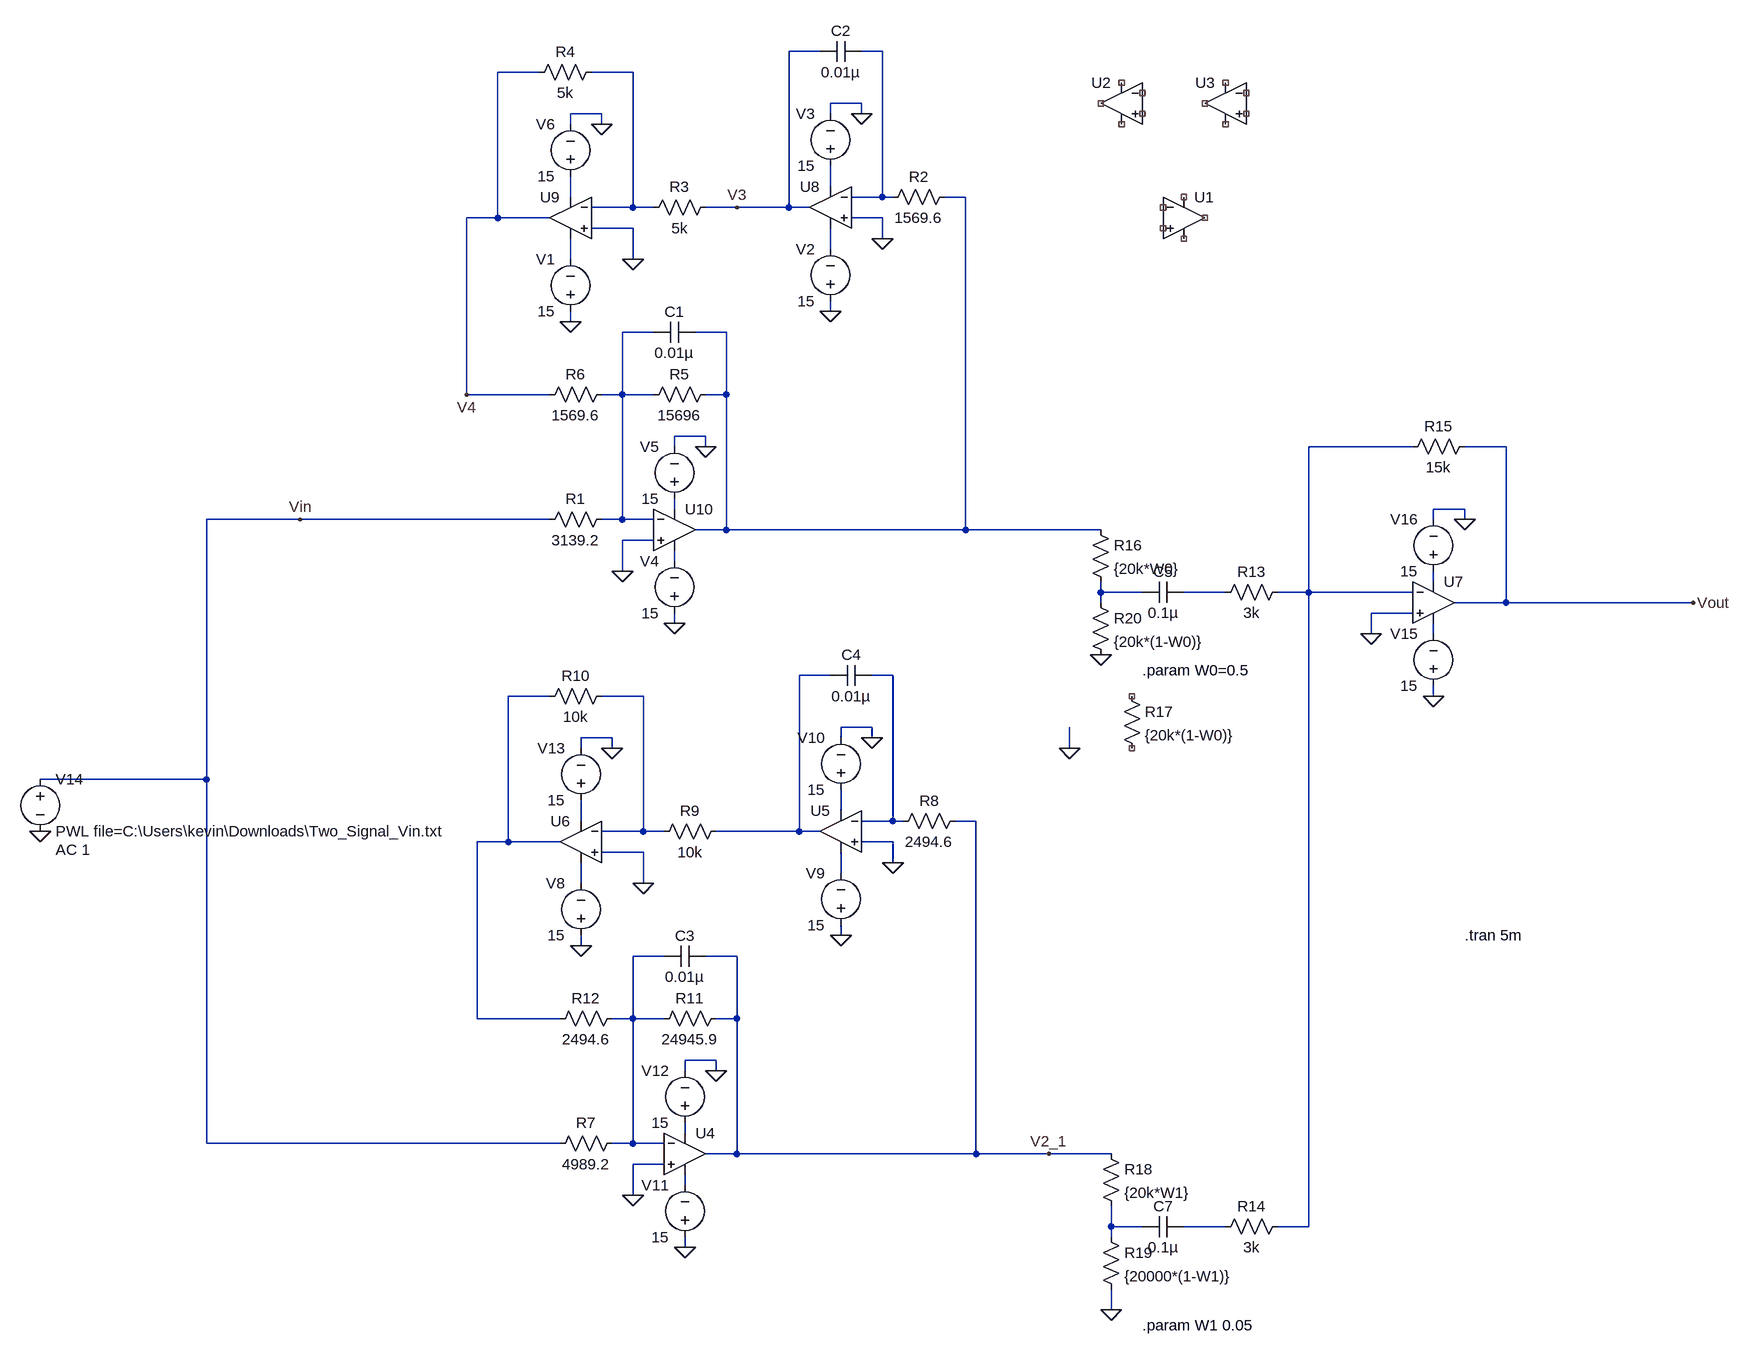
[diagram p0: schematic Full_Equalizer_Circuit_with_Noise.asc]
Full_Equalizer_Circuit_with_Noise.asc, the LTspice schematic file:
Version 4.1
SHEET 1 2996 1544
WIRE 304 -432 256 -432
WIRE 400 -432 368 -432
WIRE -128 -400 -192 -400
WIRE 16 -400 -48 -400
WIRE 368 -352 320 -352
WIRE -32 -336 -80 -336
WIRE 320 -336 320 -352
WIRE 368 -336 368 -352
WIRE -80 -320 -80 -336
WIRE -32 -320 -32 -336
WIRE 320 -224 320 -256
WIRE -80 -208 -80 -240
WIRE 400 -208 400 -432
WIRE 400 -208 352 -208
WIRE 416 -208 400 -208
WIRE 528 -208 496 -208
WIRE 16 -192 16 -400
WIRE 16 -192 -48 -192
WIRE 48 -192 16 -192
WIRE 176 -192 128 -192
WIRE 256 -192 256 -432
WIRE 256 -192 176 -192
WIRE 288 -192 256 -192
WIRE -192 -176 -192 -400
WIRE -192 -176 -240 -176
WIRE -112 -176 -192 -176
WIRE 400 -176 352 -176
WIRE 16 -160 -48 -160
WIRE 400 -144 400 -176
WIRE 320 -128 320 -160
WIRE -80 -112 -80 -144
WIRE 16 -112 16 -160
WIRE 320 -32 320 -48
WIRE -80 -16 -80 -32
WIRE 48 0 0 0
WIRE 160 0 112 0
WIRE -240 96 -240 -176
WIRE -112 96 -240 96
WIRE 0 96 0 0
WIRE 0 96 -32 96
WIRE 48 96 0 96
WIRE 160 96 160 0
WIRE 160 96 128 96
WIRE 128 160 80 160
WIRE 80 176 80 160
WIRE 128 176 128 160
WIRE 1216 176 1056 176
WIRE 1360 176 1296 176
WIRE 80 272 80 256
WIRE 1296 272 1248 272
WIRE -496 288 -640 288
WIRE -112 288 -496 288
WIRE 0 288 0 96
WIRE 0 288 -32 288
WIRE 48 288 0 288
WIRE 1248 288 1248 272
WIRE 1296 288 1296 272
WIRE 160 304 160 96
WIRE 160 304 112 304
WIRE 528 304 528 -208
WIRE 528 304 160 304
WIRE 736 304 528 304
WIRE 48 320 0 320
WIRE 80 352 80 336
WIRE 0 368 0 320
WIRE 1248 384 1248 368
WIRE 736 400 736 384
WIRE 800 400 736 400
WIRE 928 400 864 400
WIRE 1056 400 1056 176
WIRE 1056 400 1008 400
WIRE 1216 400 1056 400
WIRE 736 416 736 400
WIRE 1360 416 1360 176
WIRE 1360 416 1280 416
WIRE 1648 416 1360 416
WIRE 1216 432 1152 432
WIRE 80 448 80 432
WIRE 1152 464 1152 432
WIRE 1248 464 1248 448
WIRE 320 528 272 528
WIRE 416 528 384 528
WIRE -112 560 -176 560
WIRE 32 560 -32 560
WIRE 1248 560 1248 544
WIRE 384 608 336 608
WIRE -16 624 -64 624
WIRE 336 624 336 608
WIRE 384 624 384 608
WIRE -64 640 -64 624
WIRE -16 640 -16 624
WIRE 688 640 688 608
WIRE -640 688 -640 288
WIRE -640 688 -896 688
WIRE 336 736 336 704
WIRE -64 752 -64 720
WIRE 416 752 416 528
WIRE 416 752 368 752
WIRE 432 752 416 752
WIRE 544 752 512 752
WIRE 32 768 32 560
WIRE 32 768 -32 768
WIRE 64 768 32 768
WIRE 272 768 272 528
WIRE 272 768 144 768
WIRE 304 768 272 768
WIRE -176 784 -176 560
WIRE -176 784 -224 784
WIRE -96 784 -176 784
WIRE 416 784 368 784
WIRE 32 800 -32 800
WIRE 416 816 416 784
WIRE 336 832 336 800
WIRE -64 848 -64 816
WIRE 32 848 32 800
WIRE 336 928 336 912
WIRE -64 944 -64 928
WIRE 64 960 16 960
WIRE 176 960 128 960
WIRE -224 1056 -224 784
WIRE -96 1056 -224 1056
WIRE 16 1056 16 960
WIRE 16 1056 -16 1056
WIRE 64 1056 16 1056
WIRE 176 1056 176 960
WIRE 176 1056 144 1056
WIRE 144 1120 96 1120
WIRE 96 1136 96 1120
WIRE 144 1136 144 1120
WIRE 96 1232 96 1216
WIRE -640 1248 -640 688
WIRE -96 1248 -640 1248
WIRE 16 1248 16 1056
WIRE 16 1248 -16 1248
WIRE 64 1248 16 1248
WIRE 176 1264 176 1056
WIRE 176 1264 128 1264
WIRE 544 1264 544 752
WIRE 544 1264 176 1264
WIRE 656 1264 544 1264
WIRE 752 1264 656 1264
WIRE 64 1280 16 1280
WIRE 96 1312 96 1296
WIRE 16 1328 16 1280
WIRE 752 1376 752 1344
WIRE 800 1376 752 1376
WIRE 928 1376 864 1376
WIRE 1056 1376 1056 400
WIRE 1056 1376 1008 1376
WIRE 752 1392 752 1376
WIRE 96 1408 96 1392
WIRE 752 1504 752 1472
FLAG 0 368 0
FLAG 16 -112 0
FLAG 176 -192 V3
FLAG -80 -16 0
FLAG 368 -336 0
FLAG 320 -32 0
FLAG 128 176 0
FLAG 80 448 0
FLAG -240 96 V4
FLAG 400 -144 0
FLAG -32 -320 0
FLAG 16 1328 0
FLAG 32 848 0
FLAG -64 944 0
FLAG 384 624 0
FLAG 336 928 0
FLAG 144 1136 0
FLAG 96 1408 0
FLAG 416 816 0
FLAG -16 640 0
FLAG 1296 288 0
FLAG 1248 560 0
FLAG 1152 464 0
FLAG 1648 416 Vout
FLAG 688 640 0
FLAG 752 1504 0
FLAG -896 768 0
FLAG -496 288 Vin
FLAG 656 1264 V2_1
FLAG 736 496 0
SYMBOL res -16 272 R90
WINDOW 0 0 56 VBottom 2
WINDOW 3 32 56 VTop 2
SYMATTR InstName R1
SYMATTR Value 3139.2
SYMBOL res 512 -224 R90
WINDOW 0 0 56 VBottom 2
WINDOW 3 32 56 VTop 2
SYMATTR InstName R2
SYMATTR Value 1569.6
SYMBOL res 144 -208 R90
WINDOW 0 0 56 VBottom 2
WINDOW 3 32 56 VTop 2
SYMATTR InstName R3
SYMATTR Value 5k
SYMBOL voltage -80 -16 R180
WINDOW 0 24 96 Left 2
WINDOW 3 24 16 Left 2
SYMATTR InstName V1
SYMATTR Value 15
SYMBOL res -32 -416 R90
WINDOW 0 0 56 VBottom 2
WINDOW 3 32 56 VTop 2
SYMATTR InstName R4
SYMATTR Value 5k
SYMBOL voltage 320 -32 R180
WINDOW 0 24 96 Left 2
WINDOW 3 24 16 Left 2
SYMATTR InstName V2
SYMATTR Value 15
SYMBOL voltage 320 -240 R180
WINDOW 0 24 96 Left 2
WINDOW 3 24 16 Left 2
SYMATTR InstName V3
SYMATTR Value 15
SYMBOL voltage 80 448 R180
WINDOW 0 24 96 Left 2
WINDOW 3 24 16 Left 2
SYMATTR InstName V4
SYMATTR Value 15
SYMBOL voltage 80 272 R180
WINDOW 0 24 96 Left 2
WINDOW 3 24 16 Left 2
SYMATTR InstName V5
SYMATTR Value 15
SYMBOL res 144 80 R90
WINDOW 0 0 56 VBottom 2
WINDOW 3 32 56 VTop 2
SYMATTR InstName R5
SYMATTR Value 15696
SYMBOL cap 112 -16 R90
WINDOW 0 0 32 VBottom 2
WINDOW 3 32 32 VTop 2
SYMATTR InstName C1
SYMATTR Value 0.01µ
SYMBOL cap 368 -448 R90
WINDOW 0 0 32 VBottom 2
WINDOW 3 32 32 VTop 2
SYMATTR InstName C2
SYMATTR Value 0.01µ
SYMBOL res -16 80 R90
WINDOW 0 0 56 VBottom 2
WINDOW 3 32 56 VTop 2
SYMATTR InstName R6
SYMATTR Value 1569.6
SYMBOL voltage -80 -224 R180
WINDOW 0 24 96 Left 2
WINDOW 3 24 16 Left 2
SYMATTR InstName V6
SYMATTR Value 15
SYMBOL res 0 1232 R90
WINDOW 0 0 56 VBottom 2
WINDOW 3 32 56 VTop 2
SYMATTR InstName R7
SYMATTR Value 4989.2
SYMBOL res 528 736 R90
WINDOW 0 0 56 VBottom 2
WINDOW 3 32 56 VTop 2
SYMATTR InstName R8
SYMATTR Value 2494.6
SYMBOL res 160 752 R90
WINDOW 0 0 56 VBottom 2
WINDOW 3 32 56 VTop 2
SYMATTR InstName R9
SYMATTR Value 10k
SYMBOL voltage -64 944 R180
WINDOW 0 24 96 Left 2
WINDOW 3 24 16 Left 2
SYMATTR InstName V8
SYMATTR Value 15
SYMBOL res -16 544 R90
WINDOW 0 0 56 VBottom 2
WINDOW 3 32 56 VTop 2
SYMATTR InstName R10
SYMATTR Value 10k
SYMBOL voltage 336 928 R180
WINDOW 0 24 96 Left 2
WINDOW 3 24 16 Left 2
SYMATTR InstName V9
SYMATTR Value 15
SYMBOL voltage 336 720 R180
WINDOW 0 24 96 Left 2
WINDOW 3 24 16 Left 2
SYMATTR InstName V10
SYMATTR Value 15
SYMBOL voltage 96 1408 R180
WINDOW 0 24 96 Left 2
WINDOW 3 24 16 Left 2
SYMATTR InstName V11
SYMATTR Value 15
SYMBOL voltage 96 1232 R180
WINDOW 0 24 96 Left 2
WINDOW 3 24 16 Left 2
SYMATTR InstName V12
SYMATTR Value 15
SYMBOL res 160 1040 R90
WINDOW 0 0 56 VBottom 2
WINDOW 3 32 56 VTop 2
SYMATTR InstName R11
SYMATTR Value 24945.9
SYMBOL cap 128 944 R90
WINDOW 0 0 32 VBottom 2
WINDOW 3 32 32 VTop 2
SYMATTR InstName C3
SYMATTR Value 0.01µ
SYMBOL cap 384 512 R90
WINDOW 0 0 32 VBottom 2
WINDOW 3 32 32 VTop 2
SYMATTR InstName C4
SYMATTR Value 0.01µ
SYMBOL res 0 1040 R90
WINDOW 0 0 56 VBottom 2
WINDOW 3 32 56 VTop 2
SYMATTR InstName R12
SYMATTR Value 2494.6
SYMBOL voltage -64 736 R180
WINDOW 0 24 96 Left 2
WINDOW 3 24 16 Left 2
SYMATTR InstName V13
SYMATTR Value 15
SYMBOL cap 864 384 R90
WINDOW 0 0 32 VBottom 2
WINDOW 3 32 32 VTop 2
SYMATTR InstName C5
SYMATTR Value 0.1µ
SYMBOL cap 864 1360 R90
WINDOW 0 0 32 VBottom 2
WINDOW 3 32 32 VTop 2
SYMATTR InstName C7
SYMATTR Value 0.1µ
SYMBOL res 1024 384 R90
WINDOW 0 0 56 VBottom 2
WINDOW 3 32 56 VTop 2
SYMATTR InstName R13
SYMATTR Value 3k
SYMBOL res 1024 1360 R90
WINDOW 0 0 56 VBottom 2
WINDOW 3 32 56 VTop 2
SYMATTR InstName R14
SYMATTR Value 3k
SYMBOL voltage 1248 560 R180
WINDOW 0 24 96 Left 2
WINDOW 3 24 16 Left 2
SYMATTR InstName V15
SYMATTR Value 15
SYMBOL voltage 1248 384 R180
WINDOW 0 24 96 Left 2
WINDOW 3 24 16 Left 2
SYMATTR InstName V16
SYMATTR Value 15
SYMBOL res 1312 160 R90
WINDOW 0 0 56 VBottom 2
WINDOW 3 32 56 VTop 2
SYMATTR InstName R15
SYMATTR Value 15k
SYMBOL res 720 288 R0
SYMATTR InstName R16
SYMATTR Value {20k*W0}
SYMBOL res 768 544 R0
SYMATTR InstName R17
SYMATTR Value {20k*(1-W0)}
SYMBOL res 736 1248 R0
SYMATTR InstName R18
SYMATTR Value {20k*W1}
SYMBOL res 736 1376 R0
SYMATTR InstName R19
SYMATTR Value {20000*(1-W1)}
SYMBOL voltage -896 672 R0
WINDOW 123 24 124 Left 2
WINDOW 39 0 0 Left 0
SYMATTR Value2 AC 1
SYMATTR InstName V14
SYMATTR Value PWL file=C:\Users\kevin\Downloads\Two_Signal_Vin.txt
SYMBOL OpAmps\\UniversalOpAmp2 864 -176 R0
SYMATTR InstName U1
SYMBOL OpAmps\\UniversalOpAmp2 768 -352 M0
SYMATTR InstName U2
SYMBOL OpAmps\\UniversalOpAmp2 928 -352 M0
SYMATTR InstName U3
SYMBOL OpAmps\\UniversalOpAmp2 320 -192 M0
SYMATTR InstName U8
SYMBOL OpAmps\\UniversalOpAmp2 -80 -176 M0
SYMATTR InstName U9
SYMBOL OpAmps\\UniversalOpAmp2 80 304 R0
SYMATTR InstName U10
SYMBOL OpAmps\\UniversalOpAmp2 96 1264 R0
SYMATTR InstName U4
SYMBOL OpAmps\\UniversalOpAmp2 336 768 M0
SYMATTR InstName U5
SYMBOL OpAmps\\UniversalOpAmp2 -64 784 M0
SYMATTR InstName U6
SYMBOL OpAmps\\UniversalOpAmp2 1248 416 R0
SYMATTR InstName U7
SYMBOL res 720 400 R0
SYMATTR InstName R20
SYMATTR Value {20k*(1-W0)}
TEXT 800 520 Left 2 !.param W0=0.5
TEXT 800 1528 Left 2 !.param W1 0.05
TEXT 1296 928 Left 2 !.tran 5m

The netlist it stands for:
* Full_Equalizer_Circuit_with_Noise.asc
R1 N008 Vin 3139.2
R2 N005 N001 1569.6
R3 V3 N002 5k
V1 0 N007 15
R4 N002 V4 5k
V2 0 N006 15
V3 N003 0 15
V4 0 N011 15
V5 N010 0 15
R5 N005 N008 15696
C1 N005 N008 0.01µ
C2 N001 V3 0.01µ
R6 N008 V4 1569.6
V6 N004 0 15
R7 N024 Vin 4989.2
R8 V2_1 N017 2494.6
R9 N016 N019 10k
V8 0 N023 15
R10 N019 N018 10k
V9 0 N022 15
V10 N020 0 15
V11 0 N026 15
V12 N025 0 15
R11 V2_1 N024 24945.9
C3 V2_1 N024 0.01µ
C4 N017 N016 0.01µ
R12 N024 N018 2494.6
V13 N021 0 15
C5 N014 N013 0.1µ
C7 N028 N027 0.1µ
R13 N009 N014 3k
R14 N009 N028 3k
V15 0 N015 15
V16 N012 0 15
R15 Vout N009 15k
R16 N005 N013 {20k*W0}
R17 NC_01 NC_02 {20k*(1-W0)}
R18 V2_1 N027 {20k*W1}
R19 N027 0 {20000*(1-W1)}
V14 Vin 0 PWL file=C:\Users\kevin\Downloads\Two_Signal_Vin.txt AC 1
X§U1 NC_03 NC_04 NC_05 NC_06 NC_07 level2 Avol=1Meg GBW=10Meg Slew=10Meg Ilimit=25m Rail=0 Vos=0 En=0 Enk=0 In=0 Ink=0 Rin=500Meg  ; pins In+ In- V+ V- OUT
X§U2 NC_08 NC_09 NC_10 NC_11 NC_12 level2 Avol=1Meg GBW=10Meg Slew=10Meg Ilimit=25m Rail=0 Vos=0 En=0 Enk=0 In=0 Ink=0 Rin=500Meg  ; pins In+ In- V+ V- OUT
X§U3 NC_13 NC_14 NC_15 NC_16 NC_17 level2 Avol=1Meg GBW=10Meg Slew=10Meg Ilimit=25m Rail=0 Vos=0 En=0 Enk=0 In=0 Ink=0 Rin=500Meg  ; pins In+ In- V+ V- OUT
X§U8 0 N001 N003 N006 V3 level2 Avol=1Meg GBW=10Meg Slew=10Meg Ilimit=25m Rail=0 Vos=0 En=0 Enk=0 In=0 Ink=0 Rin=500Meg  ; pins In+ In- V+ V- OUT
X§U9 0 N002 N004 N007 V4 level2 Avol=1Meg GBW=10Meg Slew=10Meg Ilimit=25m Rail=0 Vos=0 En=0 Enk=0 In=0 Ink=0 Rin=500Meg  ; pins In+ In- V+ V- OUT
X§U10 0 N008 N010 N011 N005 level2 Avol=1Meg GBW=10Meg Slew=10Meg Ilimit=25m Rail=0 Vos=0 En=0 Enk=0 In=0 Ink=0 Rin=500Meg  ; pins In+ In- V+ V- OUT
X§U4 0 N024 N025 N026 V2_1 level2 Avol=1Meg GBW=10Meg Slew=10Meg Ilimit=25m Rail=0 Vos=0 En=0 Enk=0 In=0 Ink=0 Rin=500Meg  ; pins In+ In- V+ V- OUT
X§U5 0 N017 N020 N022 N016 level2 Avol=1Meg GBW=10Meg Slew=10Meg Ilimit=25m Rail=0 Vos=0 En=0 Enk=0 In=0 Ink=0 Rin=500Meg  ; pins In+ In- V+ V- OUT
X§U6 0 N019 N021 N023 N018 level2 Avol=1Meg GBW=10Meg Slew=10Meg Ilimit=25m Rail=0 Vos=0 En=0 Enk=0 In=0 Ink=0 Rin=500Meg  ; pins In+ In- V+ V- OUT
X§U7 0 N009 N012 N015 Vout level2 Avol=1Meg GBW=10Meg Slew=10Meg Ilimit=25m Rail=0 Vos=0 En=0 Enk=0 In=0 Ink=0 Rin=500Meg  ; pins In+ In- V+ V- OUT
R20 N013 0 {20k*(1-W0)}
.param W0=0.5
.param W1 0.05
.tran 5m
.lib UniversalOpAmp2.lib
.backanno
.end